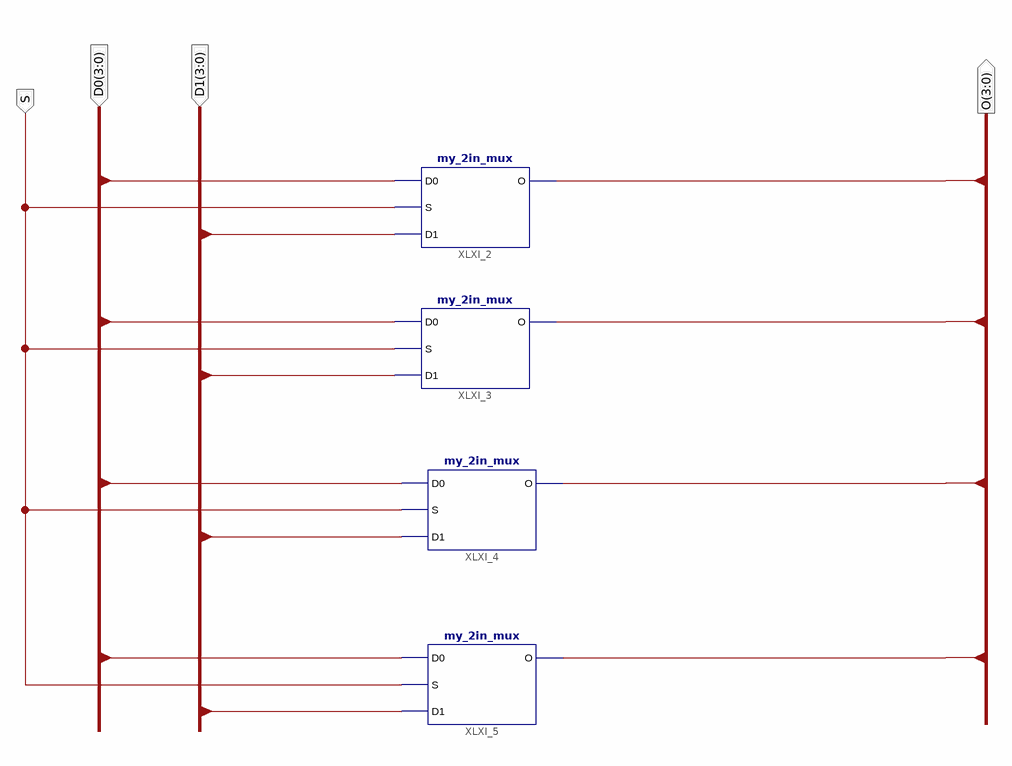
[diagram p0: schematic sheet 1]
// Xilinx ISE schematic my_mux4_2to1.sch (virtex6) as structural Verilog: 4 symbols, 4 ports
module my_mux4_2to1 (
  input  [3:0] D0,
  input  [3:0] D1,
  input  S,
  output [3:0] O
);

  my_2in_mux XLXI_2 (.D0(D0[0]), .D1(D1[0]), .O(O[0]), .S(S));
  my_2in_mux XLXI_3 (.D0(D0[1]), .D1(D1[1]), .O(O[1]), .S(S));
  my_2in_mux XLXI_4 (.D0(D0[2]), .D1(D1[2]), .O(O[2]), .S(S));
  my_2in_mux XLXI_5 (.D0(D0[3]), .D1(D1[3]), .O(O[3]), .S(S));
endmodule
